# EasyEDA schematic SCH_Satlla_4_Power_Board_2023-01-29.json
TITLE: Power_Board_128x58; REV: 1.0; Date: 2021-01-31; Sheet: 1/1; Drawn By: KCG LAB; Company: KCG LAB
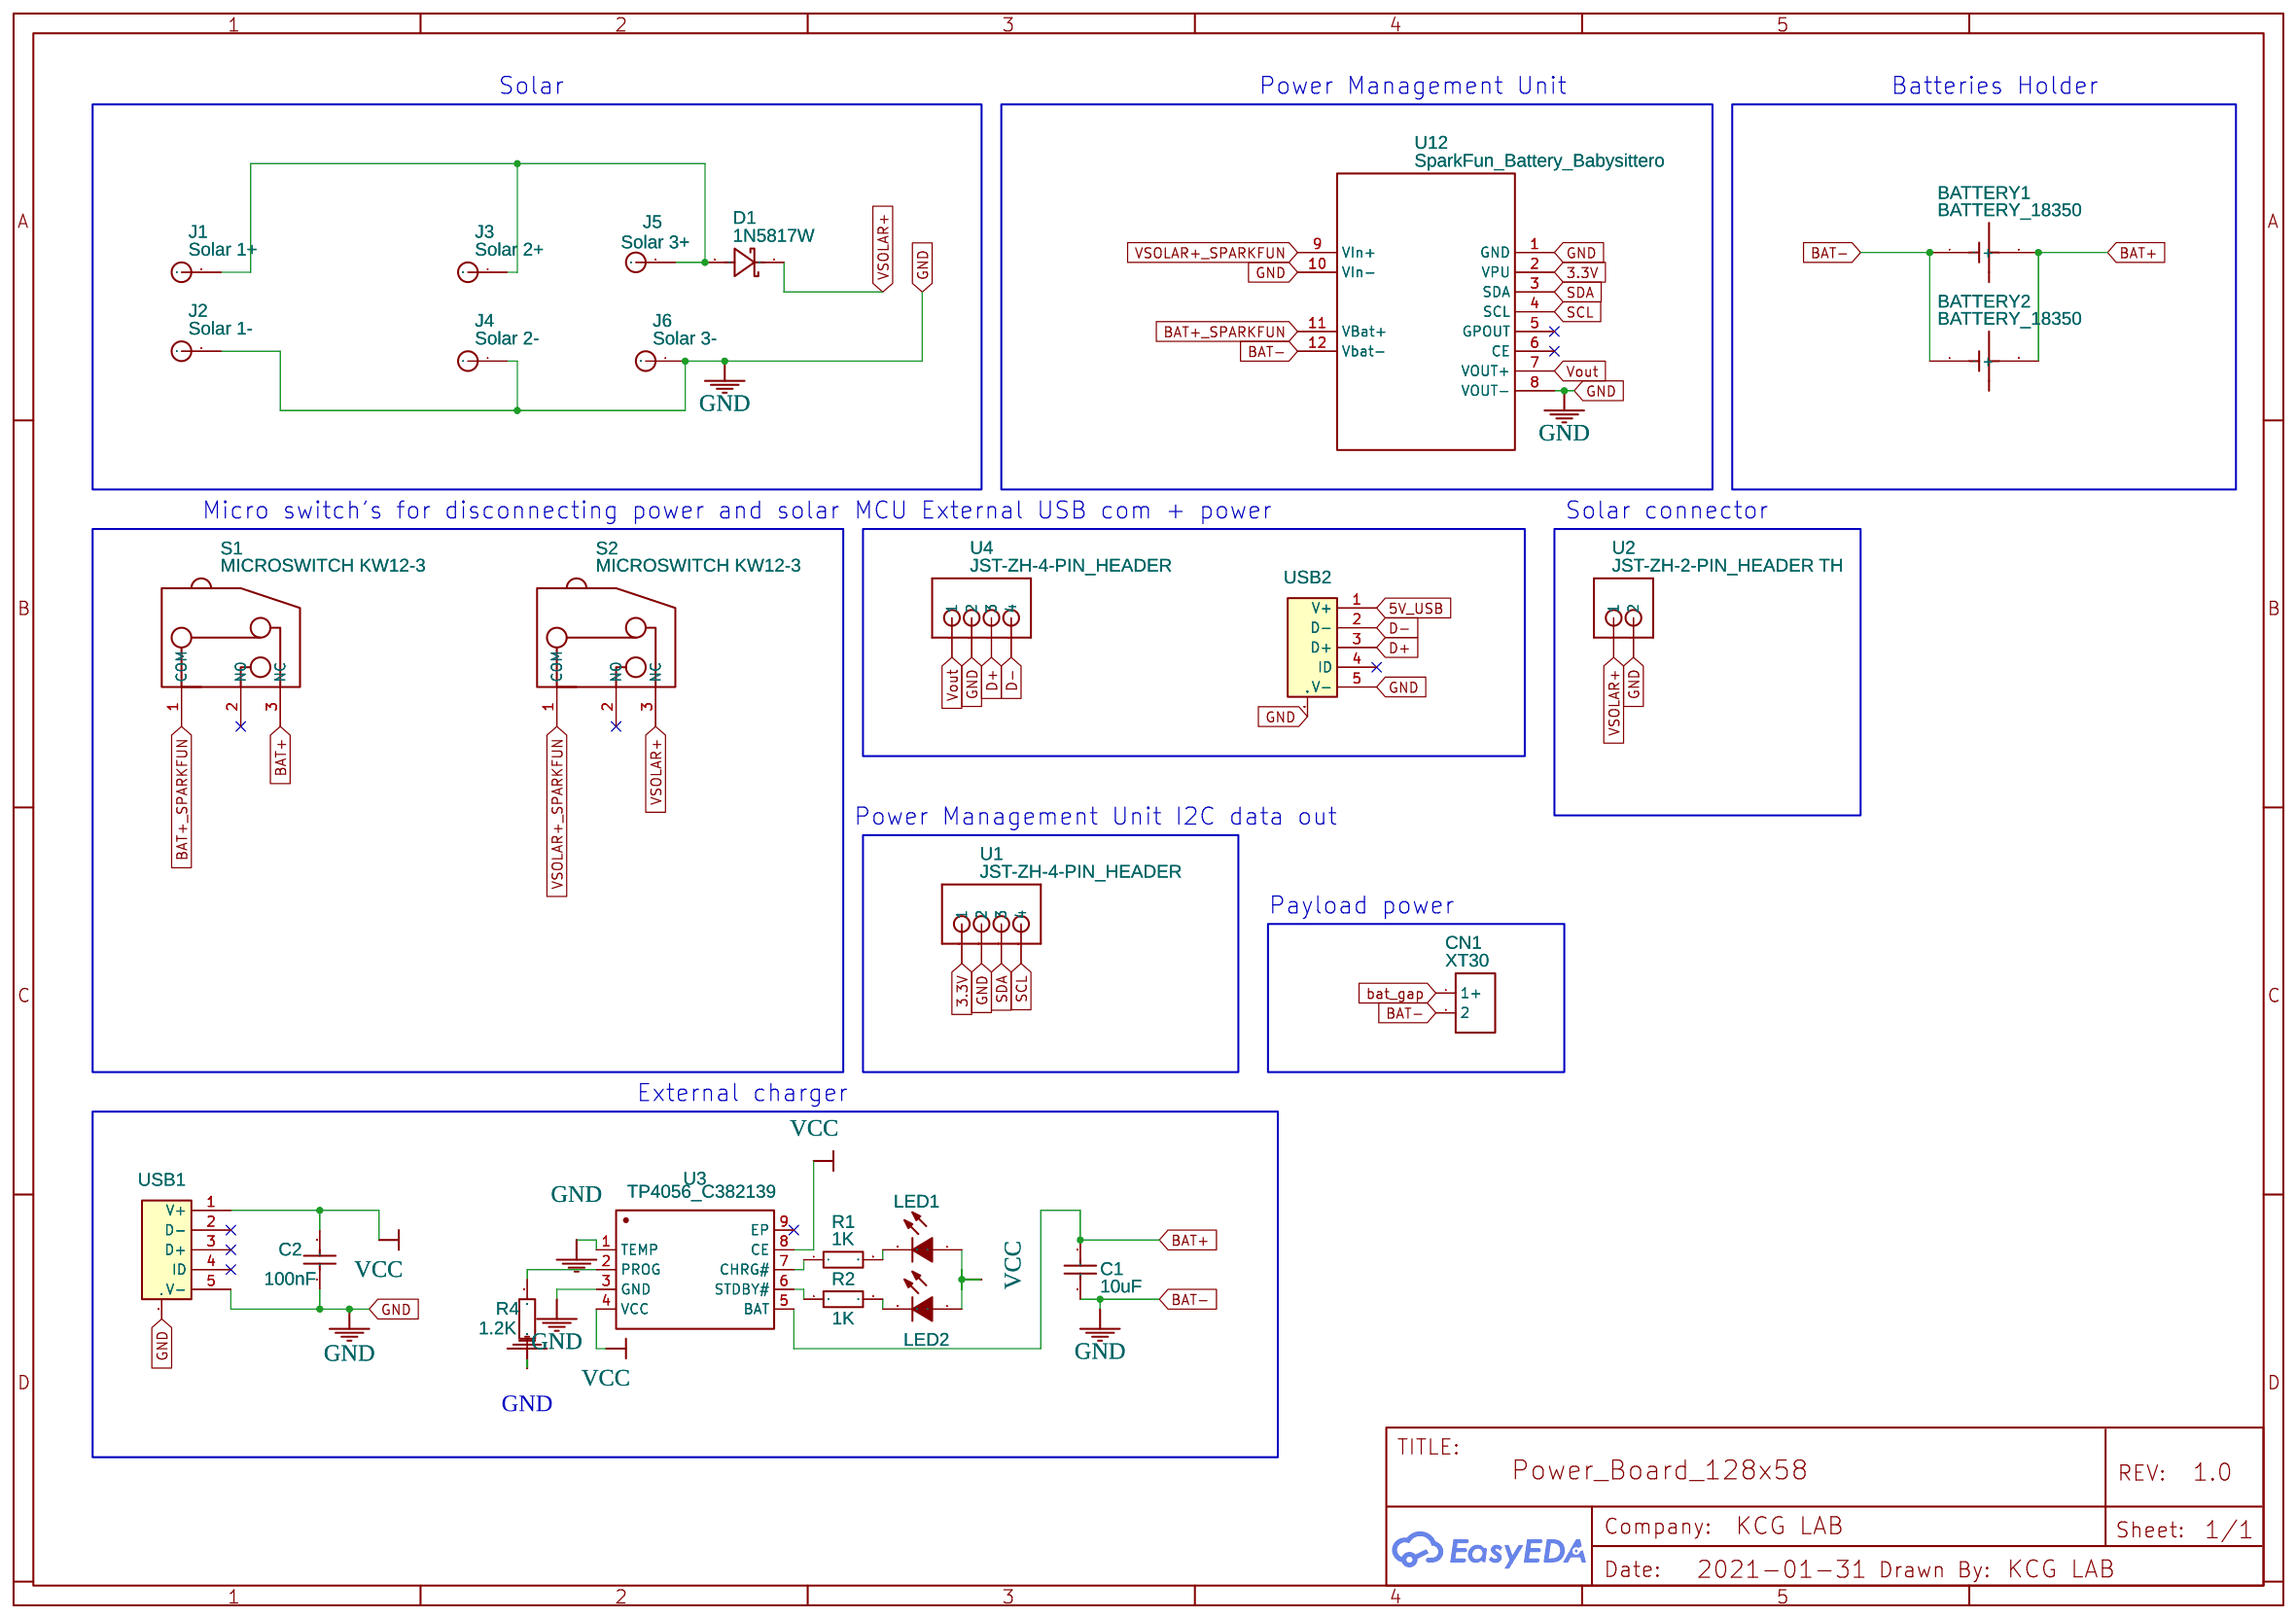
[diagram p0: schematic sheet]

## Parts
BATTERY1  BATTERY_18350  [18350 WITH PROTECTION]
BATTERY2  BATTERY_18350  [18350 WITH PROTECTION]
C1  10uF  [C1206]
C2  100nF  [C1206]
CN1  XT30  [CONN-TH_XT30UPB-F]
D1  1N5817W  [SOD-123_L2.8-W1.8-LS3.7-RD]
J1  Solar 1+  [CONNECTOR]
J2  Solar 1-  [CONNECTOR]
J3  Solar 2+  [CONNECTOR]
J4  Solar 2-  [CONNECTOR]
J5  Solar 3+  [CONNECTOR]
J6  Solar 3-  [CONNECTOR]
LED1  17-21SURC/S530-A3/TR8  [LED0805-R-RD]
LED2  17-21SURC/S530-A3/TR8  [LED0805-R-RD]
R1  1K  [R1206]
R2  1K  [R1206]
R4  1.2K  [R1206]
S1  MICROSWITCH KW12-3  [BI0002405]
S2  MICROSWITCH KW12-3  [BI0002405]
U1  JST-ZH-4-PIN_HEADER  [JST-ZH-4 1.5MM]
U2  JST-ZH-2-PIN_HEADER TH  [JST-ZH-2 1.5MM TH]
U3  TP4056_C382139  [ESOP-8_L4.9-W3.9-P1.27-LS6.0-BL-EP]
U4  JST-ZH-4-PIN_HEADER  [JST-ZH-4 1.5MM]
U12  SparkFun_Battery_Babysittero  [SPARKFUN_BATTERY_BABYSITTE_KCG]
USB1  micro 5PFour-legged board7.2There is a column card point0.4m  [MICRO-USB-SMD_5P-P0.65-H-F-C40943]
USB2  micro 5PFour-legged board7.2There is a column card point0.4m  [MICRO-USB-SMD_5P-P0.65-H-F-C40943]

## Library data of the parts
BATTERY1 = BATTERY_18350: Manufacturer: https://www.keyelco.com/product.cfm/For-17-19mm-Dia-Lithium-Ion-Batteries/54/product_id/826; Manufacturer Part: file:///Users/leo/Downloads/54.PDF; Contributor: LeonidStep; Package Display: No
BATTERY2 = BATTERY_18350: Manufacturer: https://www.keyelco.com/product.cfm/For-17-19mm-Dia-Lithium-Ion-Batteries/54/product_id/826; Manufacturer Part: file:///Users/leo/Downloads/54.PDF; Contributor: LeonidStep
C1 = CL31A106KBHNNNE: Supplier: LCSC; Manufacturer: SAMSUNG; Supplier Part: C13585; JLCPCB Part Class: Basic Part
C2 = CL31B104KBCNNNC: Supplier: LCSC; Manufacturer: SAMSUNG; Supplier Part: C24497; JLCPCB Part Class: Basic Part
CN1 = XT30UPB-F ARUN: Supplier: LCSC; Supplier Part: C108769; Manufacturer Part: XT30UPB-F; Contributor: LCSC; JLCPCB Part Class: Extended Part
D1 = 1N5817W: Supplier: LCSC; Supplier Part: C727113; Manufacturer: TWGMC; Contributor: LCSC; SMT Type: Extend; JLCPCB SMD: Yes; LCSC Assembly: Yes
J1-J6 = Connector: DIP Black Round Female Header VERT;; Supplier Part: 320030026; Supplier: SeeedStudio; Manufacturer Part: RF130-1013BBS0741; sourceId: kPDdb8uQO; Contributor: Jayadamski
LED1 LED2 = -: Supplier: LCSC; Manufacturer: EVERLIGHT; image: //image.lceda.cn/szlcsc/C72037.jpg; Supplier Part: C72037; LCSC Assembly: Yes; SMT Type: Extend
R1 R2 = RK73B2BTTD102J: Supplier: LCSC; Supplier Part: C192527; Manufacturer: KOA Speer Elec; Contributor: LCSC; JLCPCB Part Class: Extended Part
R4 = RMC12061.2K1%N: Supplier: LCSC; Supplier Part: C269579; Manufacturer: Tyohm; Contributor: LCSC; JLCPCB Part Class: Extended Part
S1 S2 = MICROSWITCH KW12-3: Manufacturer: Panasonic; Manufacturer Part: AVT34243; Supplier: RS-Online; Supplier Part: 173-8372; Contributor: iwanczuk
U1 U4 = JST-ZH-4-PIN_HEADER
U2 = JST-ZH-2-PIN_HEADER TH: Contributor: Herve Goncalves
U3 = -: Supplier: LCSC; Supplier Part: C382139; Manufacturer: TPOWER; Manufacturer Part: TP4056; Contributor: LCSC
U12 = SparkFun_Battery_Babysittero: Manufacturer Part: SparkFun; Contributor: CedricC
USB1 USB2 = micro 5PFour-legged board7.2There is a column card point0.4m: Supplier: LCSC; Manufacturer: ValuePro; Supplier Part: C40943; JLCPCB Part Class: Extended Part

## Nets
3.3V: U1.P1(1) U12.2(VPU)
5V_USB: USB2.1(V+)
VCC: C2.2 LED1.1(A) LED2.1(A) U3.4(VCC) U3.8(CE) USB1.1(V+)
BAT+: BATTERY1.2(+) BATTERY2.2(+) C1.2 S1.3(NC) U3.5(BAT)
BAT+_SPARKFUN: S1.1(COM) U12.11(VBat+)
BAT-: BATTERY1.1(-) BATTERY2.1(-) C1.1 C2.1 CN1.2 J2.1 J4.1 J6.1 R4.2 U1.P2(2) U2.2 U3.1(TEMP) U3.3(GND) U4.P2(2) U12.1(GND) U12.8(VOUT-) U12.10(VIn-) U12.12(Vbat-) USB1.0(MTN6) USB1.5(V-) USB2.0(MTN6) USB2.5(V-)
bat_gap: CN1.1(1+)
D+: U4.P3(3) USB2.3(D+)
D-: U4.P4(4) USB2.2(D-)
SCL: U1.P4(4) U12.4(SCL)
SDA: U1.P3(3) U12.3(SDA)
Vout: U4.P1(1) U12.7(VOUT+)
VSOLAR+: D1.1(C) S2.3(NC) U2.1
VSOLAR+_SPARKFUN: S2.1(COM) U12.9(VIn+)
Net-(D1-2): D1.2(A) J1.1 J3.1 J5.1
Net-(LED1-2): LED1.2(C) R1.2
Net-(LED2-2): LED2.2(C) R2.2
Net-(R1-1): R1.1 U3.7(CHRG#)
Net-(R2-1): R2.1 U3.6(STDBY#)
Net-(R4-1): R4.1 U3.2(PROG)

Not connected (* = marked no-connect by the designer): S1 2(NO)*; S2 2(NO)*; U3 9(EP)*; U12 5(GPOUT)* 6(CE)*; USB1 2(D-)* 3(D+)* 4(ID)*; USB2 4(ID)*

## Notes on the sheet
- Solar
- Power Management Unit
- Batteries Holder
- Micro switch's for disconnecting power and solar
- MCU External USB com + power
- Solar connector
- Power Management Unit I2C data out
- Payload power
- External charger
